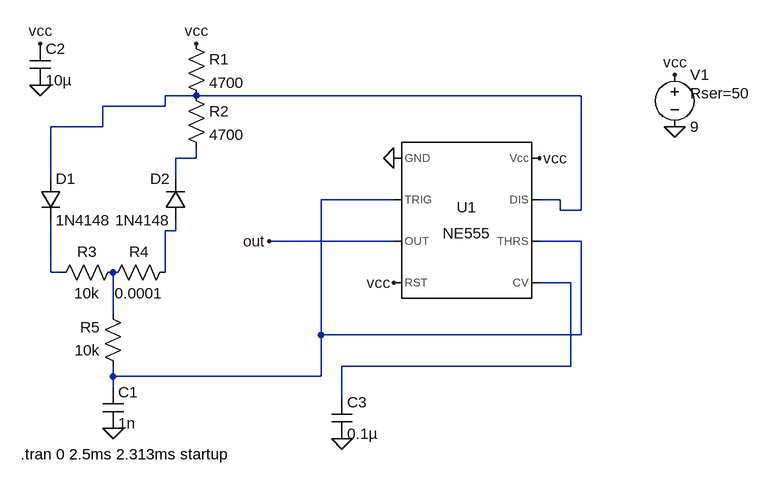
[diagram p0: schematic osilador con preset, no son independientes.asc]
osilador con preset, no son independientes.asc, the LTspice schematic file:
Version 4
SHEET 1 880 680
WIRE -352 -128 -400 -128
WIRE 240 -128 -352 -128
WIRE -400 -112 -400 -128
WIRE -400 -112 -496 -112
WIRE -496 -80 -496 -112
WIRE -496 -80 -576 -80
WIRE -352 -32 -352 -48
WIRE -352 -32 -384 -32
WIRE -576 0 -576 -80
WIRE -384 0 -384 -32
WIRE -48 32 -160 32
WIRE 208 32 176 32
WIRE 208 48 208 32
WIRE 240 48 240 -128
WIRE 240 48 208 48
WIRE -384 80 -384 64
WIRE -384 80 -400 80
WIRE -48 96 -240 96
WIRE 240 96 176 96
WIRE -576 144 -576 64
WIRE -560 144 -576 144
WIRE -400 144 -400 80
WIRE 224 160 176 160
WIRE -480 208 -480 144
WIRE -160 240 -160 32
WIRE 240 240 240 96
WIRE 240 240 -160 240
WIRE 224 288 224 160
WIRE 224 288 -128 288
WIRE -480 304 -480 288
WIRE -160 304 -160 240
WIRE -160 304 -480 304
WIRE -480 320 -480 304
WIRE -128 336 -128 288
FLAG -48 -32 0
FLAG 176 -32 vcc
FLAG 384 -80 0
FLAG 384 -160 vcc
FLAG -592 -144 0
FLAG -592 -208 vcc
FLAG -352 -208 vcc
FLAG -48 160 vcc
FLAG -480 384 0
FLAG -128 400 0
FLAG -240 96 out
SYMBOL Misc\\NE555 64 64 R0
SYMATTR InstName U1
SYMBOL voltage 384 -176 R0
WINDOW 123 0 0 Left 0
WINDOW 39 24 44 Left 2
SYMATTR InstName V1
SYMATTR Value 9
SYMATTR SpiceLine Rser=50
SYMBOL cap -496 320 R0
SYMATTR InstName C1
SYMATTR Value 1n
SYMBOL cap -608 -208 R0
SYMATTR InstName C2
SYMATTR Value 10µ
SYMBOL cap -144 336 R0
SYMATTR InstName C3
SYMATTR Value 0.1µ
SYMBOL res -368 -224 R0
SYMATTR InstName R1
SYMATTR Value 4700
SYMBOL res -368 -144 R0
SYMATTR InstName R2
SYMATTR Value 4700
SYMBOL res -464 128 R90
WINDOW 0 0 56 VBottom 2
WINDOW 3 32 56 VTop 2
SYMATTR InstName R3
SYMATTR Value 10k
SYMBOL res -384 128 R90
WINDOW 0 0 56 VBottom 2
WINDOW 3 32 56 VTop 2
SYMATTR InstName R4
SYMATTR Value 0.0001
SYMBOL res -464 304 R180
WINDOW 0 36 76 Left 2
WINDOW 3 36 40 Left 2
SYMATTR InstName R5
SYMATTR Value 10k
SYMBOL diode -592 0 R0
SYMATTR InstName D1
SYMATTR Value 1N4148
SYMBOL diode -368 64 R180
WINDOW 0 24 64 Left 2
WINDOW 3 24 0 Left 2
SYMATTR InstName D2
SYMATTR Value 1N4148
TEXT -622 424 Left 2 !.tran 0 2.5ms 2.313ms startup

The netlist it stands for:
* osilador con preset, no son independientes.asc
XU1 0 N003 out vcc N006 N003 N001 vcc NE555  ; pins GND TRIG OUT RST CV THRS DIS Vcc
V1 vcc 0 9 Rser=50
C1 N003 0 1n
C2 vcc 0 10µ
C3 N006 0 0.1µ
R1 vcc N001 4700
R2 N001 N002 4700
R3 N007 N005 10k
R4 N004 N007 0.0001
R5 N003 N007 10k
D1 N001 N005 1N4148
D2 N004 N002 1N4148
.model D D
.lib standard.dio
.tran 0 2.5ms 2.313ms startup
.lib NE555.sub
.backanno
.end